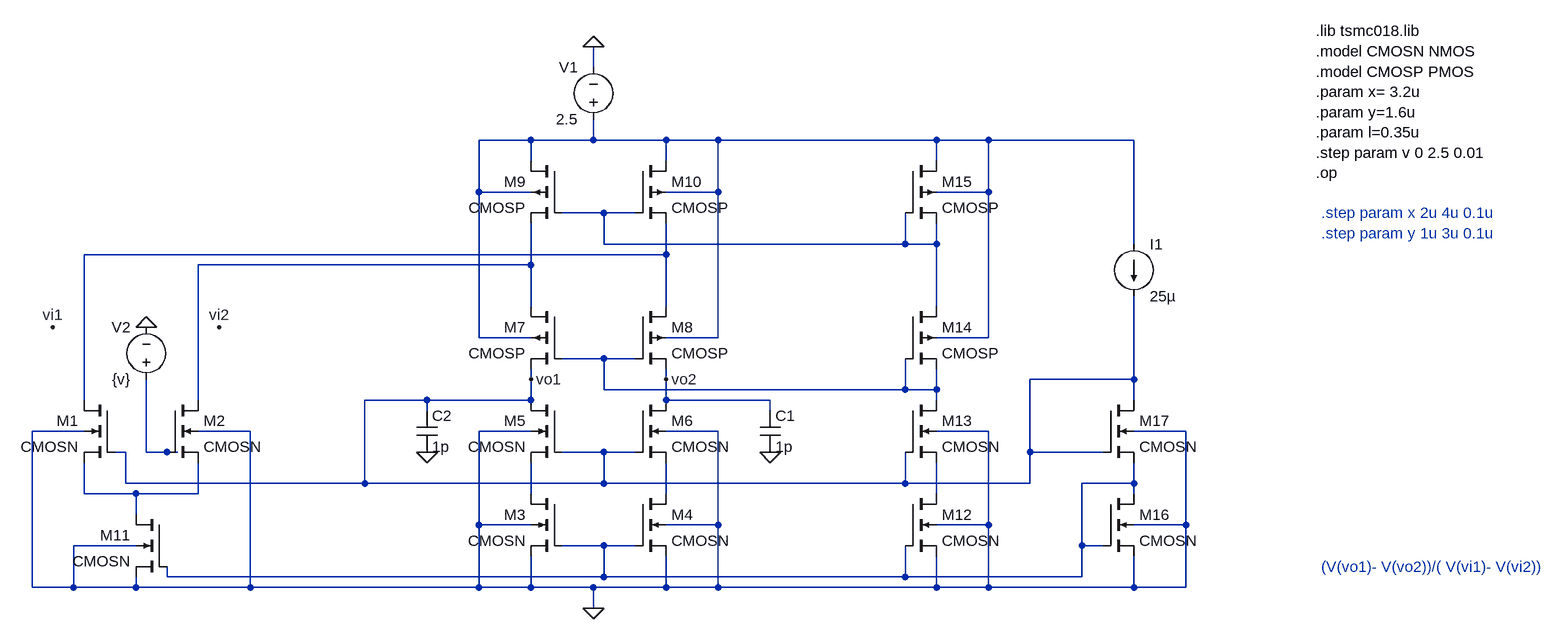
[diagram p0: schematic Draft1 - ICMR.asc]
Draft1 - ICMR.asc, the LTspice schematic file:
Version 4
SHEET 1 2420 2676
WIRE 624 -512 624 -544
WIRE 528 -400 448 -400
WIRE 624 -400 624 -432
WIRE 624 -400 528 -400
WIRE 736 -400 624 -400
WIRE 816 -400 736 -400
WIRE 1152 -400 816 -400
WIRE 1232 -400 1152 -400
WIRE 1456 -400 1232 -400
WIRE 528 -368 528 -400
WIRE 736 -368 736 -400
WIRE 1152 -368 1152 -400
WIRE 448 -320 448 -400
WIRE 528 -320 448 -320
WIRE 816 -320 816 -400
WIRE 816 -320 736 -320
WIRE 1232 -320 1232 -400
WIRE 1232 -320 1152 -320
WIRE 640 -288 576 -288
WIRE 688 -288 640 -288
WIRE 640 -240 640 -288
WIRE 1104 -240 1104 -288
WIRE 1104 -240 640 -240
WIRE 1152 -240 1152 -272
WIRE 1152 -240 1104 -240
WIRE 1456 -240 1456 -400
WIRE 736 -224 736 -272
WIRE 736 -224 -160 -224
WIRE 528 -208 528 -272
WIRE 528 -208 16 -208
WIRE 528 -144 528 -208
WIRE 736 -144 736 -224
WIRE 1152 -144 1152 -240
WIRE 448 -96 448 -320
WIRE 528 -96 448 -96
WIRE 816 -96 816 -320
WIRE 816 -96 736 -96
WIRE 1232 -96 1232 -320
WIRE 1232 -96 1152 -96
WIRE 640 -64 576 -64
WIRE 688 -64 640 -64
WIRE 528 -32 528 -48
WIRE 736 -32 736 -48
WIRE 1456 -32 1456 -160
WIRE 1456 -32 1296 -32
WIRE 640 -16 640 -64
WIRE 1104 -16 1104 -64
WIRE 1104 -16 640 -16
WIRE 1152 -16 1152 -48
WIRE 1152 -16 1104 -16
WIRE -160 0 -160 -224
WIRE 16 0 16 -208
WIRE 368 0 272 0
WIRE 528 0 528 -32
WIRE 528 0 368 0
WIRE 736 0 736 -32
WIRE 896 0 736 0
WIRE 1152 0 1152 -16
WIRE 1456 0 1456 -32
WIRE 368 16 368 0
WIRE 736 16 736 0
WIRE 896 16 896 0
WIRE -160 48 -240 48
WIRE 96 48 16 48
WIRE 528 48 448 48
WIRE 816 48 736 48
WIRE 1232 48 1152 48
WIRE 1536 48 1456 48
WIRE -96 80 -112 80
WIRE -64 80 -64 -32
WIRE -32 80 -64 80
WIRE -16 80 -32 80
WIRE 640 80 576 80
WIRE 688 80 640 80
WIRE 1296 80 1296 -32
WIRE 1408 80 1296 80
WIRE -96 128 -96 80
WIRE 272 128 272 0
WIRE 272 128 -96 128
WIRE 640 128 640 80
WIRE 640 128 272 128
WIRE 1104 128 1104 80
WIRE 1104 128 640 128
WIRE 1296 128 1296 80
WIRE 1296 128 1104 128
WIRE 1456 128 1456 96
WIRE 1456 128 1376 128
WIRE -160 144 -160 96
WIRE -80 144 -160 144
WIRE 16 144 16 96
WIRE 16 144 -80 144
WIRE 528 144 528 96
WIRE 736 144 736 96
WIRE 1152 144 1152 96
WIRE 1456 144 1456 128
WIRE -80 176 -80 144
WIRE 448 192 448 48
WIRE 528 192 448 192
WIRE 816 192 816 48
WIRE 816 192 736 192
WIRE 1232 192 1232 48
WIRE 1232 192 1152 192
WIRE 1536 192 1536 48
WIRE 1536 192 1456 192
WIRE -80 224 -176 224
WIRE 640 224 576 224
WIRE 688 224 640 224
WIRE 1376 224 1376 128
WIRE 1408 224 1376 224
WIRE -32 272 -32 256
WIRE 640 272 640 224
WIRE 640 272 -32 272
WIRE 1104 272 1104 224
WIRE 1104 272 640 272
WIRE 1376 272 1376 224
WIRE 1376 272 1104 272
WIRE -240 288 -240 48
WIRE -176 288 -176 224
WIRE -176 288 -240 288
WIRE -80 288 -80 272
WIRE -80 288 -176 288
WIRE 96 288 96 48
WIRE 96 288 -80 288
WIRE 448 288 448 192
WIRE 448 288 96 288
WIRE 528 288 528 240
WIRE 528 288 448 288
WIRE 624 288 528 288
WIRE 736 288 736 240
WIRE 736 288 624 288
WIRE 816 288 816 192
WIRE 816 288 736 288
WIRE 1152 288 1152 240
WIRE 1152 288 816 288
WIRE 1232 288 1232 192
WIRE 1232 288 1152 288
WIRE 1456 288 1456 240
WIRE 1456 288 1232 288
WIRE 1536 288 1536 192
WIRE 1536 288 1456 288
WIRE 624 320 624 288
FLAG 624 320 0
FLAG 624 -544 0
FLAG 528 -32 vo1
FLAG 736 -32 vo2
FLAG 48 -112 vi2
FLAG -208 -112 vi1
FLAG 368 80 0
FLAG 896 80 0
FLAG -64 -112 0
SYMBOL nmos4 -32 0 R0
SYMATTR InstName M2
SYMATTR Value CMOSN
SYMATTR Value2 l={l} w={x}
SYMBOL nmos4 -112 0 M0
SYMATTR InstName M1
SYMATTR Value CMOSN
SYMATTR Value2 l={l} w={x}
SYMBOL nmos4 576 144 M0
SYMATTR InstName M3
SYMATTR Value CMOSN
SYMATTR Value2 l={l} w={x}
SYMBOL nmos4 688 144 R0
SYMATTR InstName M4
SYMATTR Value CMOSN
SYMATTR Value2 l={l} w={x}
SYMBOL nmos4 576 0 M0
SYMATTR InstName M5
SYMATTR Value CMOSN
SYMATTR Value2 l={l} w={x}
SYMBOL nmos4 688 0 R0
SYMATTR InstName M6
SYMATTR Value CMOSN
SYMATTR Value2 l={l} w={x}
SYMBOL nmos4 -32 176 M0
SYMATTR InstName M11
SYMATTR Value CMOSN
SYMATTR Value2 l={l} w={2*x}
SYMBOL pmos4 576 -144 M0
SYMATTR InstName M7
SYMATTR Value CMOSP
SYMATTR Value2 l={l} w={y}
SYMBOL pmos4 688 -144 R0
SYMATTR InstName M8
SYMATTR Value CMOSP
SYMATTR Value2 l={l} w={y}
SYMBOL pmos4 688 -368 R0
SYMATTR InstName M10
SYMATTR Value CMOSP
SYMATTR Value2 l={l} w={2*y}
SYMBOL pmos4 576 -368 M0
SYMATTR InstName M9
SYMATTR Value CMOSP
SYMATTR Value2 l={l} w={2*y}
SYMBOL voltage 624 -416 R180
WINDOW 0 24 96 Left 2
WINDOW 3 24 16 Left 2
WINDOW 123 0 0 Left 0
WINDOW 39 0 0 Left 0
SYMATTR InstName V1
SYMATTR Value 2.5
SYMBOL nmos4 1104 144 R0
SYMATTR InstName M12
SYMATTR Value CMOSN
SYMATTR Value2 l={l} w={x}
SYMBOL nmos4 1104 0 R0
SYMATTR InstName M13
SYMATTR Value CMOSN
SYMATTR Value2 l={l} w={x}
SYMBOL pmos4 1104 -144 R0
SYMATTR InstName M14
SYMATTR Value CMOSP
SYMATTR Value2 l={l} w={y}
SYMBOL pmos4 1104 -368 R0
SYMATTR InstName M15
SYMATTR Value CMOSP
SYMATTR Value2 l={l} w={y}
SYMBOL nmos4 1408 144 R0
SYMATTR InstName M16
SYMATTR Value CMOSN
SYMATTR Value2 l={l} w={x}
SYMBOL nmos4 1408 0 R0
SYMATTR InstName M17
SYMATTR Value CMOSN
SYMATTR Value2 l={l} w={x}
SYMBOL current 1456 -240 R0
WINDOW 123 0 0 Left 0
WINDOW 39 0 0 Left 0
SYMATTR InstName I1
SYMATTR Value 25µ
SYMBOL cap 880 16 R0
SYMATTR InstName C1
SYMATTR Value 1p
SYMBOL cap 352 16 R0
SYMATTR InstName C2
SYMATTR Value 1p
SYMBOL voltage -64 -16 R180
WINDOW 0 24 96 Left 2
WINDOW 3 24 16 Left 2
SYMATTR InstName V2
SYMATTR Value {v}
TEXT 1736 -568 Left 2 !.lib tsmc018.lib\n.model CMOSN NMOS\n.model CMOSP PMOS\n.param x= 3.2u\n.param y=1.6u\n.param l=0.35u\n.step param v 0 2.5 0.01\n.op
TEXT 1744 256 Left 2 ;(V(vo1)- V(vo2))/( V(vi1)- V(vi2))
TEXT 1744 -288 Left 2 ;.step param x 2u 4u 0.1u \n.step param y 1u 3u 0.1u

The netlist it stands for:
* Draft1 - ICMR.asc
M2 N004 N006 N008 0 CMOSN l={l} w={x}
M1 N003 vo1 N008 0 CMOSN l={l} w={x}
M3 N009 N007 0 0 CMOSN l={l} w={x}
M4 N010 N007 0 0 CMOSN l={l} w={x}
M5 vo1 vo1 N009 0 CMOSN l={l} w={x}
M6 vo2 vo1 N010 0 CMOSN l={l} w={x}
M11 N008 N007 0 0 CMOSN l={l} w={2*x}
M7 N004 N005 vo1 N001 CMOSP l={l} w={y}
M8 N003 N005 vo2 N001 CMOSP l={l} w={y}
M10 N001 N002 N003 N001 CMOSP l={l} w={2*y}
M9 N001 N002 N004 N001 CMOSP l={l} w={2*y}
V1 N001 0 2.5
M12 N011 N007 0 0 CMOSN l={l} w={x}
M13 N005 vo1 N011 0 CMOSN l={l} w={x}
M14 N002 N005 N005 N001 CMOSP l={l} w={y}
M15 N001 N002 N002 N001 CMOSP l={l} w={y}
M16 N007 N007 0 0 CMOSN l={l} w={x}
M17 vo1 vo1 N007 0 CMOSN l={l} w={x}
I1 N001 vo1 25µ
C1 vo2 0 1p
C2 vo1 0 1p
V2 N006 0 {v}
.model NMOS NMOS
.model PMOS PMOS
.lib standard.mos
.lib tsmc018.lib
.model CMOSN NMOS
.model CMOSP PMOS
.param x= 3.2u
.param y=1.6u
.param l=0.35u
.step param v 0 2.5 0.01
.op
* (V(vo1)- V(vo2))/( V(vi1)- V(vi2))
* .step param x 2u 4u 0.1u
* .step param y 1u 3u 0.1u
.backanno
.end

* Results of the author's LTspice run, read from the files saved beside the schematic
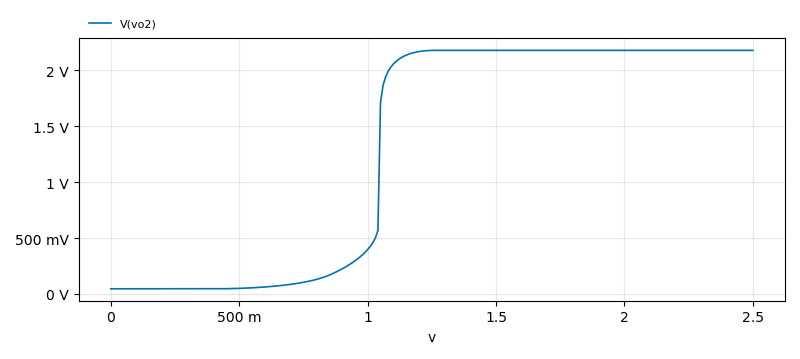
[diagram p1: Operating Point of Draft1 - ICMR.asc, plotted from the saved traces]
* Operating Point, 1 run:
*   V(vo2): 46.02 mV at v=0, 2.178 V at v=2.5 , min 46.02 mV, max 2.178 V
* From the log:
*   Semiconductor Device Operating Points:
*                           --- MOSFET Transistors ---
*   Name:          m15         m14         m9          m10         m8
*   Model:        cmosp       cmosp       cmosp       cmosp       cmosp
*   Id:           3.69e-5     3.69e-5     5.86e-5     7.38e-5     3.70e-6
*   Vgs:          0.00e+0     0.00e+0    -4.07e-1     6.14e-1     6.57e-1
*   Vds:          8.98e-1     8.98e-1     4.91e-1     1.51e+0     9.42e-1
*   Vbs:          8.98e-1     1.80e+0     4.91e-1     1.51e+0     2.45e+0
*   Vth:         -0.00e+0    -0.00e+0    -0.00e+0    -0.00e+0    -0.00e+0
*   Vdsat:       -8.98e-1    -8.98e-1    -8.98e-1    -8.98e-1    -2.85e-1
*   Gm:           8.21e-5     8.21e-5     8.98e-5     1.64e-4     2.60e-5
*   Gds:          0.00e+0     0.00e+0     7.44e-5     0.00e+0     0.00e+0
*   Gmb:          0.00e+0     0.00e+0     0.00e+0     0.00e+0     0.00e+0
*   Cbd:          0.00e+0     0.00e+0     0.00e+0     0.00e+0     0.00e+0
*   Cbs:          0.00e+0     0.00e+0     0.00e+0     0.00e+0     0.00e+0
*   Cgsov:        0.00e+0     0.00e+0     0.00e+0     0.00e+0     0.00e+0
*   Cgdov:        0.00e+0     0.00e+0     0.00e+0     0.00e+0     0.00e+0
*   Cgbov:        0.00e+0     0.00e+0     0.00e+0     0.00e+0     0.00e+0
*   Cgs:          0.00e+0     0.00e+0     0.00e+0     0.00e+0     0.00e+0
*   Cgd:          0.00e+0     0.00e+0     0.00e+0     0.00e+0     0.00e+0
*   Cgb:          0.00e+0     0.00e+0     0.00e+0     0.00e+0     0.00e+0
*   Name:          m7          m17         m16         m13         m12
*   Model:        cmosp       cmosn       cmosn       cmosn       cmosn
*   Id:           5.86e-5     4.18e-5     4.18e-5     3.69e-5     3.69e-5
*   Vgs:         -6.49e-1     6.76e-1     6.76e-1     9.08e-1     6.76e-1
*   Vds:          6.56e-1     6.76e-1     6.76e-1     2.59e-1     4.44e-1
*   Vbs:          1.15e+0    -6.76e-1     0.00e+0    -4.44e-1     0.00e+0
*   Vth:         -0.00e+0     0.00e+0     0.00e+0     0.00e+0     0.00e+0
*   Vdsat:       -1.31e+0     6.76e-1     6.76e-1     9.08e-1     6.76e-1
*   Gm:           6.00e-5     1.24e-4     1.24e-4     4.74e-5     8.12e-5
*   Gds:          5.94e-5     0.00e+0     0.00e+0     1.19e-4     4.24e-5
*   Gmb:          0.00e+0     0.00e+0     0.00e+0     0.00e+0     0.00e+0
*   Cbd:          0.00e+0     0.00e+0     0.00e+0     0.00e+0     0.00e+0
*   Cbs:          0.00e+0     0.00e+0     0.00e+0     0.00e+0     0.00e+0
*   Cgsov:        0.00e+0     0.00e+0     0.00e+0     0.00e+0     0.00e+0
*   Cgdov:        0.00e+0     0.00e+0     0.00e+0     0.00e+0     0.00e+0
*   Cgbov:        0.00e+0     0.00e+0     0.00e+0     0.00e+0     0.00e+0
*   Cgs:          0.00e+0     0.00e+0     0.00e+0     0.00e+0     0.00e+0
*   Cgd:          0.00e+0     0.00e+0     0.00e+0     0.00e+0     0.00e+0
*   Cgb:          0.00e+0     0.00e+0     0.00e+0     0.00e+0     0.00e+0
*   Name:          m11         m6          m5          m4          m3
*   Model:        cmosn       cmosn       cmosn       cmosn       cmosn
*   Id:           7.01e-5     3.70e-6     4.18e-5     3.70e-6     4.18e-5
*   Vgs:          6.76e-1     1.32e+0     6.76e-1     6.76e-1     6.76e-1
*   Vds:          4.04e-1     1.54e-2     6.76e-1     3.06e-2     6.76e-1
*   Vbs:          0.00e+0    -3.06e-2    -6.76e-1     0.00e+0     0.00e+0
*   Vth:          0.00e+0     0.00e+0     0.00e+0     0.00e+0     0.00e+0
*   Vdsat:        6.76e-1     1.32e+0     6.76e-1     6.76e-1     6.76e-1
*   Gm:           1.48e-4     2.82e-6     1.24e-4     5.60e-6     1.24e-4
*   Gds:          9.95e-5     2.39e-4     0.00e+0     1.18e-4      NaN
*   Gmb:          0.00e+0     0.00e+0     0.00e+0     0.00e+0     0.00e+0
*   Cbd:          0.00e+0     0.00e+0     0.00e+0     0.00e+0     0.00e+0
*   Cbs:          0.00e+0     0.00e+0     0.00e+0     0.00e+0     0.00e+0
*   Cgsov:        0.00e+0     0.00e+0     0.00e+0     0.00e+0     0.00e+0
*   Cgdov:        0.00e+0     0.00e+0     0.00e+0     0.00e+0     0.00e+0
*   Cgbov:        0.00e+0     0.00e+0     0.00e+0     0.00e+0     0.00e+0
*   Cgs:          0.00e+0     0.00e+0     0.00e+0     0.00e+0     0.00e+0
*   Cgd:          0.00e+0     0.00e+0     0.00e+0     0.00e+0     0.00e+0
*   Cgb:          0.00e+0     0.00e+0     0.00e+0     0.00e+0     0.00e+0
*   Name:          m1          m2
*   Model:        cmosn       cmosn
*   Id:           7.01e-5      NaN
*   Vgs:          9.48e-1    -4.04e-1
*   Vds:          5.84e-1     1.60e+0
*   Vbs:         -4.04e-1    -4.04e-1
*   Vth:          0.00e+0     0.00e+0
*   Vdsat:        9.48e-1     0.00e+0
*   Gm:           1.07e-4     0.00e+0
*   Gds:          6.67e-5     0.00e+0
*   Gmb:          0.00e+0     0.00e+0
*   Cbd:          0.00e+0     0.00e+0
*   Cbs:          0.00e+0     0.00e+0
*   Cgsov:        0.00e+0     0.00e+0
*   Cgdov:        0.00e+0     0.00e+0
*   Cgbov:        0.00e+0     0.00e+0
*   Cgs:          0.00e+0     0.00e+0
*   Cgd:          0.00e+0     0.00e+0
*   Cgb:          0.00e+0     0.00e+0